# EAGLE design Simple Fan Controller (EAGLE 5.10)
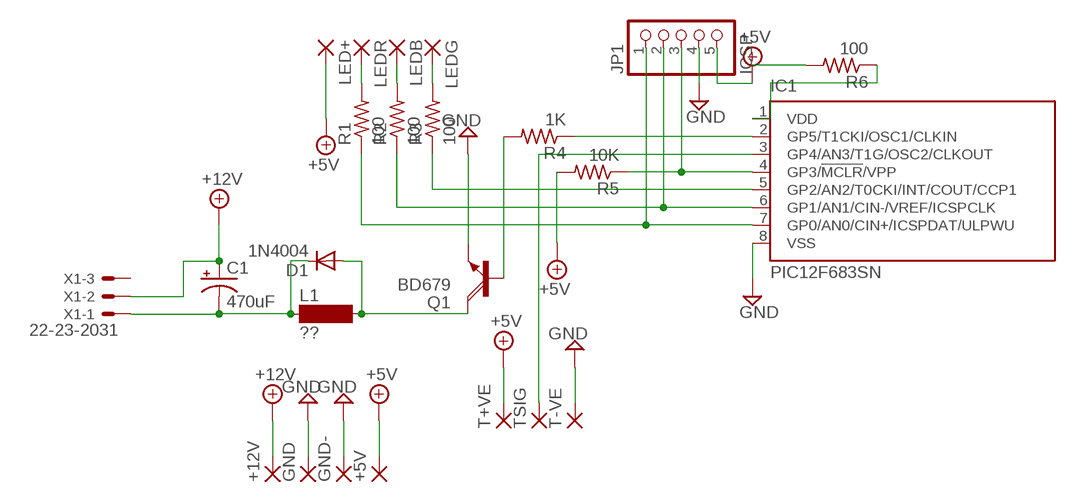
[diagram p0: schematic, sheet 1]

## Parts
+5V  2,54/1,1  [2,54/1,1]
+12V  2,54/1,1  [2,54/1,1]
C1  470uF  CPOL-USE5-10.5  [E5-10,5]
D1  1N4004  [DO41-10]
GND  2,54/1,1  [2,54/1,1]
GND-  2,54/1,1  [2,54/1,1]
IC1  PIC12F683SN  [SO-08]
JP1  ICSP  PINHD-1X5  [1X05]
L1  ??  BS11  [BS11]
LED+  2,54/1,0  [2,54/1,0]
LEDB  2,54/1,0  [2,54/1,0]
LEDG  2,54/1,0  [2,54/1,0]
LEDR  2,54/1,0  [2,54/1,0]
Q1  BD679  [TO126AV]
R1  100  R-US_0207/10  [0207/10]
R2  100  R-US_0207/10  [0207/10]
R3  100  R-US_0207/10  [0207/10]
R4  1K  R-US_0207/10  [0207/10]
R5  10K  R-US_0207/10  [0207/10]
R6  100  R-US_0207/10  [0207/10]
T+VE  2,54/1,0  [2,54/1,0]
T-VE  2,54/1,0  [2,54/1,0]
TSIG  2,54/1,0  [2,54/1,0]
X1  22-23-2031  [22-23-2031]

## Nets
+5V: +5V.1(P) JP1.5 LED+.1(P) R5.2 T+VE.1(P)
+12V: +12V.1(P) C1.+ X1.2
GND: GND-.1(P) GND.1(P) IC1.8(VSS) JP1.4 Q1.E T-VE.1(P)
N$1: IC1.2(GP5/T1CKI/OSC1/CLKIN) R4.1
N$2: Q1.B R4.2
N$3: D1.A L1.2 Q1.C
N$4: C1.- D1.C L1.1 X1.1
N$5: IC1.4(GP3/!MCLR!/VPP) JP1.3 R5.1
N$6: LEDR.1(P) R1.2
N$7: LEDB.1(P) R2.2
N$8: LEDG.1(P) R3.2
N$10: IC1.3(GP4/AN3/T1G/OSC2/CLKOUT) TSIG.1(P)
N$11: IC1.7(GP0/AN0/CIN+/ICSPDAT/ULPWU) JP1.1 R1.1
N$12: IC1.6(GP1/AN1/CIN-/VREF/ICSPCLK) JP1.2 R2.1
N$13: IC1.5(GP2/AN2/T0CKI/INT/COUT/CCP1) R3.1
N$15: R6.2
N$16: IC1.1(VDD) R6.1
Unconnected: X1.3

## Library data of the parts
+5V +12V GND GND- = wirepad:2,54/1,1: THROUGH-HOLE PAD
C1 = rcl:CPOL-US: POLARIZED CAPACITOR, American symbol
D1 = diode:1N4004: DIODE general purpose rectifier, 1 A
IC1 = microchip:PIC12F683: 8-Pin Flash-Based, 8-Bit CMOS Microcontrollers with nanoWatt Technology Source: http://ww1.microchip.com/downloads/en/DeviceDoc/41211D_.pdf
JP1 = pinhead:PINHD-1X5: PIN HEADER
L1 = inductor-neosid:BS: INDUCTOR nominal inductance, magnetically screened
LED+ LEDB LEDG LEDR T+VE T-VE TSIG = wirepad:2,54/1,0: THROUGH-HOLE PAD
Q1 = transistor-power:BD679: NPN DARLINGTON TRANSISTOR
R1-R6 = resistor:R-US_: RESISTOR, American symbol
X1 = con-molex:22-23-2031: .100" (2.54mm) Center Header - 3 Pin

## Net classes
0 default: width 0.762 mm, drill 12.7 mm

## Board
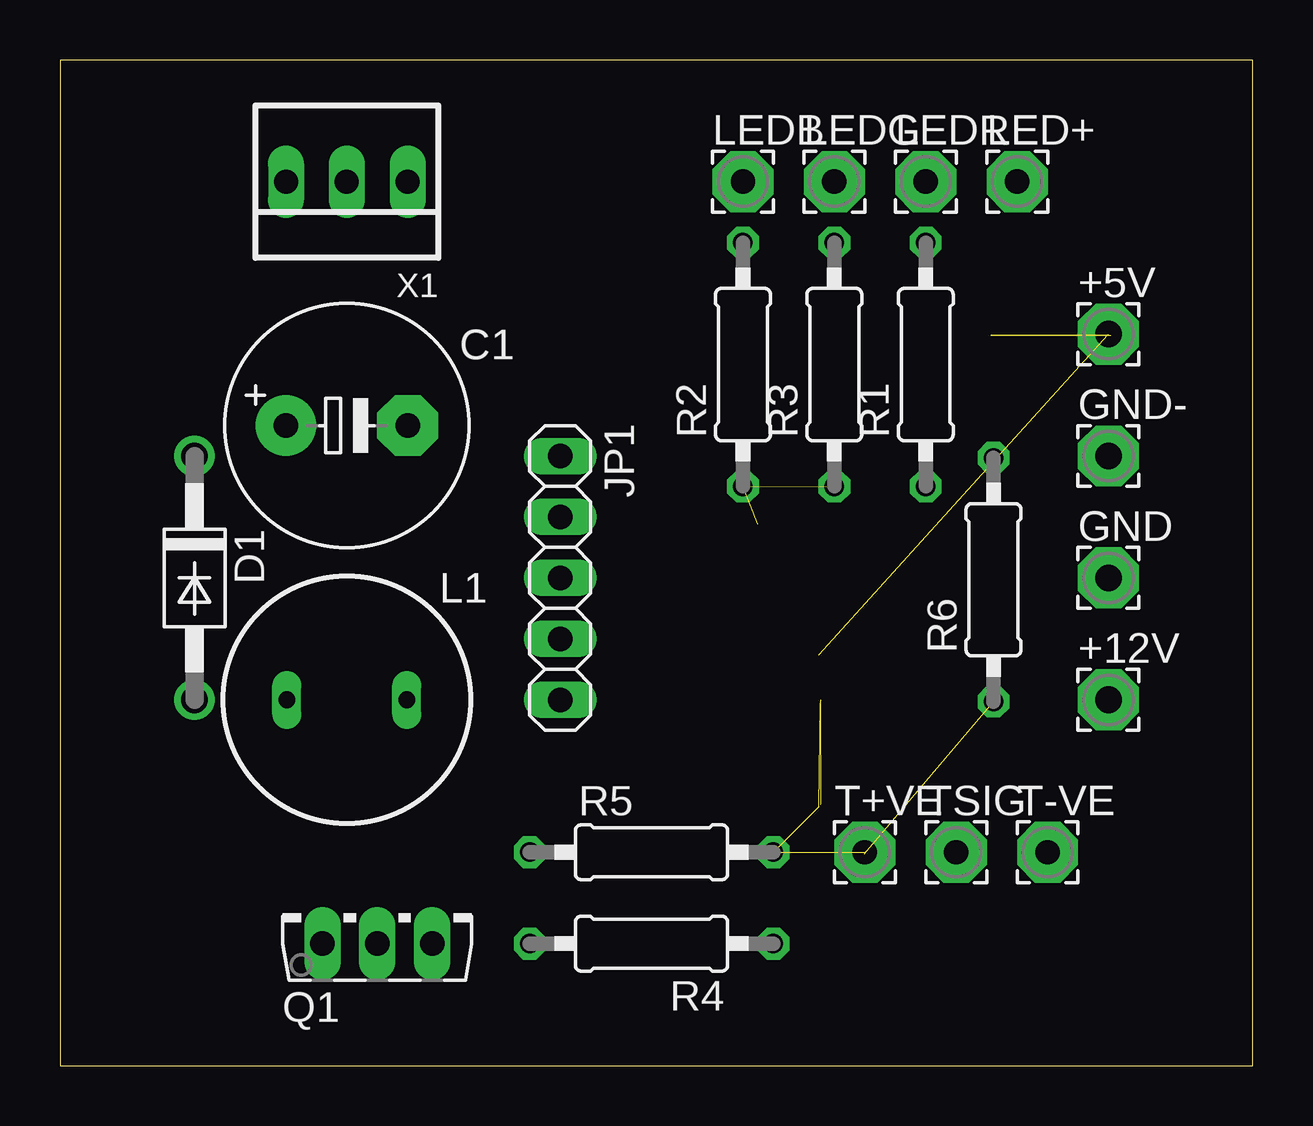
[diagram p1: board, top side]
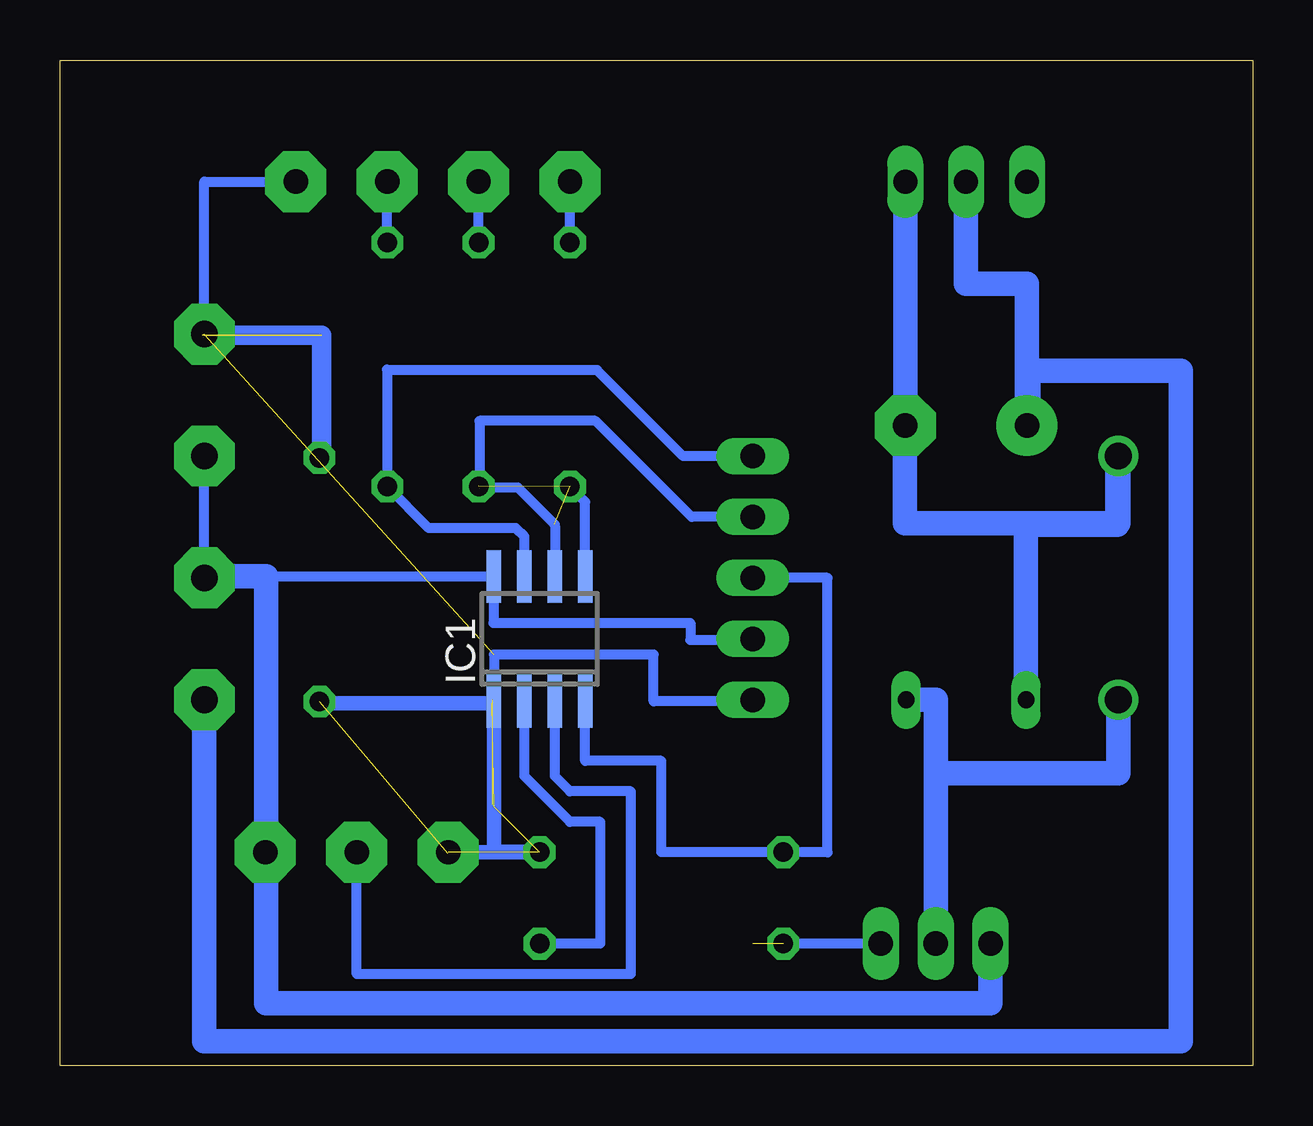
[diagram p2: board, bottom side, seen from below]

Size 49.73 x 41.9 mm. Coordinates in mm from the lower left corner, seen from the top.
Outline: 0,0 49.73,0 49.73,41.9 0,41.9 0,0
Copper layers (1*16): Top 0.035mm / dielectric 1.5mm / Bottom 0.035mm
Design rules "default": minimum track width 10mil, minimum drill 24mil, track to track 8mil, track to pad 8mil, pad to pad 8mil, via to via 8mil, smd to smd 8mil, copper to edge 40mil, drill to drill 8mil, minimum pad ring 10mil, minimum via ring 8mil, stop-mask expansion 4mil, vias tented up to drill 0mil, thermal gap 10mil

### Footprints (pad centres in the part's own frame; a part is rotated, then mirrored left to right if it is on the bottom)
2,54/1,1 = drill 1.118 pad 2.54 octagon: 1 0,0
E5-10,5 = drill 1.016 pad 2.54 round: + -2.54,0 | drill 1.016 pad 2.54 octagon: - 2.54,0
DO41-10 = drill 1.118 round: A 5.08,0; C -5.08,0
SO-08 = smd 0.6 x 2.2: 1 -1.905,-2.6; 2 -0.635,-2.6; 3 0.635,-2.6; 4 1.905,-2.6; 5 1.905,2.6; 6 0.635,2.6; 7 -0.635,2.6; 8 -1.905,2.6
1X05 = drill 1.016 long: 1 -5.08,0; 2 -2.54,0; 3 0,0; 4 2.54,0; 5 5.08,0
BS11 = drill 0.7 long: 1 -2.5,0; 2 2.5,0
2,54/1,0 = drill 1.016 pad 2.54 octagon: 1 0,0
TO126AV = drill 1.016 long: B 2.286,-1.27; C 0,-1.27; E -2.286,-1.27
0207/10 = drill 0.813 octagon: 1 -5.08,0; 2 5.08,0
22-23-2031 = drill 1 long: 1 -2.54,0; 2 0,0; 3 2.54,0

### Placement (x,y rotation side)
+5V  43.71,30.48 0 top
+12V  43.71,15.24 0 top
C1  11.96,26.67 0 top
D1  5.61,20.32 270 top
GND  43.71,20.32 0 top
GND-  43.71,25.4 0 top
IC1  29.74,17.78 0 bottom
JP1  20.85,20.32 270 top
L1  11.96,15.24 0 top
LED+  39.9,36.83 0 top
LEDB  28.47,36.83 0 top
LEDG  32.28,36.83 0 top
LEDR  36.09,36.83 0 top
Q1  13.23,6.35 0 top
R1  36.09,29.21 90 top
R2  28.47,29.21 90 top
R3  32.28,29.21 90 top
R4  24.66,5.08 180 top
R5  24.66,8.89 0 top
R6  38.91,20.24 90 top
T+VE  33.55,8.89 0 top
T-VE  41.17,8.89 0 top
TSIG  37.36,8.89 0 top
X1  11.96,36.83 180 top

### Tracks (layer width: path | path; a pad name or v marks a point on that pad's centre or on a via)
+5V  (4 unrouted)
  Bottom 0.406: LED+.1 43.71,36.83 +5V.1 | 31.71,15.09 31.71,15.24 31.64,15.24 31.64,17.12 24.98,17.12 24.98,15.18 20.85,15.18 JP1.5 | 31.71,15.09 31.68,15.09 | 31.71,15.09 31.74,15.09
+12V
  Bottom 1.016: +12V.1 43.71,1.02 3,1.02 3,28.96 9.37,28.96 9.37,26.67 C1.+ 9.42,32.58 11.96,32.58 X1.2
GND
  Bottom 0.406: GND-.1 GND.1 43.71,20.38 | JP1.4 20.85,17.74 23.45,17.74 23.45,18.45 31.66,18.45 31.66,20.38 IC1.8 41.14,20.38 41.14,20.4
  Bottom 1.016: GND.1 43.71,20.4 41.14,20.4 41.14,8.89 | Q1.E 10.94,2.6 41.14,2.6 41.14,8.89 | 41.14,8.89 T-VE.1
N$1
  Bottom 0.406: R4.1 27.2,5.08 27.2,10.16 28.47,10.16 30.37,12.06 IC1.2
N$2  (1 unrouted)
  Bottom 0.406: Q1.B R4.2
N$3
  Bottom 1.016: 13.23,12.19 Q1.C | 13.23,12.19 13.23,15.24 L1.2 | D1.A 5.61,12.19 13.23,12.19
N$4
  Bottom 1.016: L1.1 9.46,22.54 5.65,22.54 5.65,25.4 D1.C 5.61,22.59 14.51,22.59 14.51,26.67 C1.- X1.1
N$5
  Bottom 0.406: IC1.4 27.83,12.7 24.66,12.7 24.66,8.89 R5.1 17.74,8.88 17.74,20.32 JP1.3
N$6
  Bottom 0.406: R1.2 LEDR.1
N$7
  Bottom 0.406: R2.2 LEDB.1
N$8
  Bottom 0.406: R3.2 LEDG.1
N$9  (2 unrouted)
  Bottom 0.813: 38.81,25.23 38.81,30.43 43.71,30.43
N$10
  Bottom 0.406: TSIG.1 37.36,3.81 25.93,3.81 25.93,11.43 28.47,11.43 29.1,12.06 IC1.3
N$11
  Bottom 0.406: 30.37,19.68 IC1.7 30.37,22.05 30.72,22.4 34.36,22.4 R1.1 36.1,24.14 36.1,29 36.07,28.98 27.34,28.98 23.76,25.4 JP1.1
N$12  (1 unrouted)
  Bottom 0.406: 29.12,20.38 IC1.6 29.1,22.49 29.1,22.5 29.1,22.55 30.65,24.09 32.29,24.09 32.25,24.14 32.25,26.87 27.41,26.87 23.4,22.86 JP1.2
N$13  (1 unrouted)
  Bottom 0.406: IC1.5 27.83,23.48 28.47,24.12 28.49,24.12
N$14  (1 unrouted)
  Bottom 0.406: 31.71,15.25 31.64,15.25
N$16  (1 unrouted)
  Bottom 0.61: IC1.1 31.64,8.92 31.62,8.9 29.74,8.9 29.72,8.88 33.52,8.88 33.54,8.86 33.54,8.82
N$17  (1 unrouted)
  Bottom 0.406: 31.67,15.11 31.67,15.14
  Bottom 0.61: 38.95,15.14 38.95,15.1 31.66,15.1 31.66,15.12 31.71,15.12 31.73,15.12